# EAGLE design Motor controller v8 (EAGLE 7.4.0)
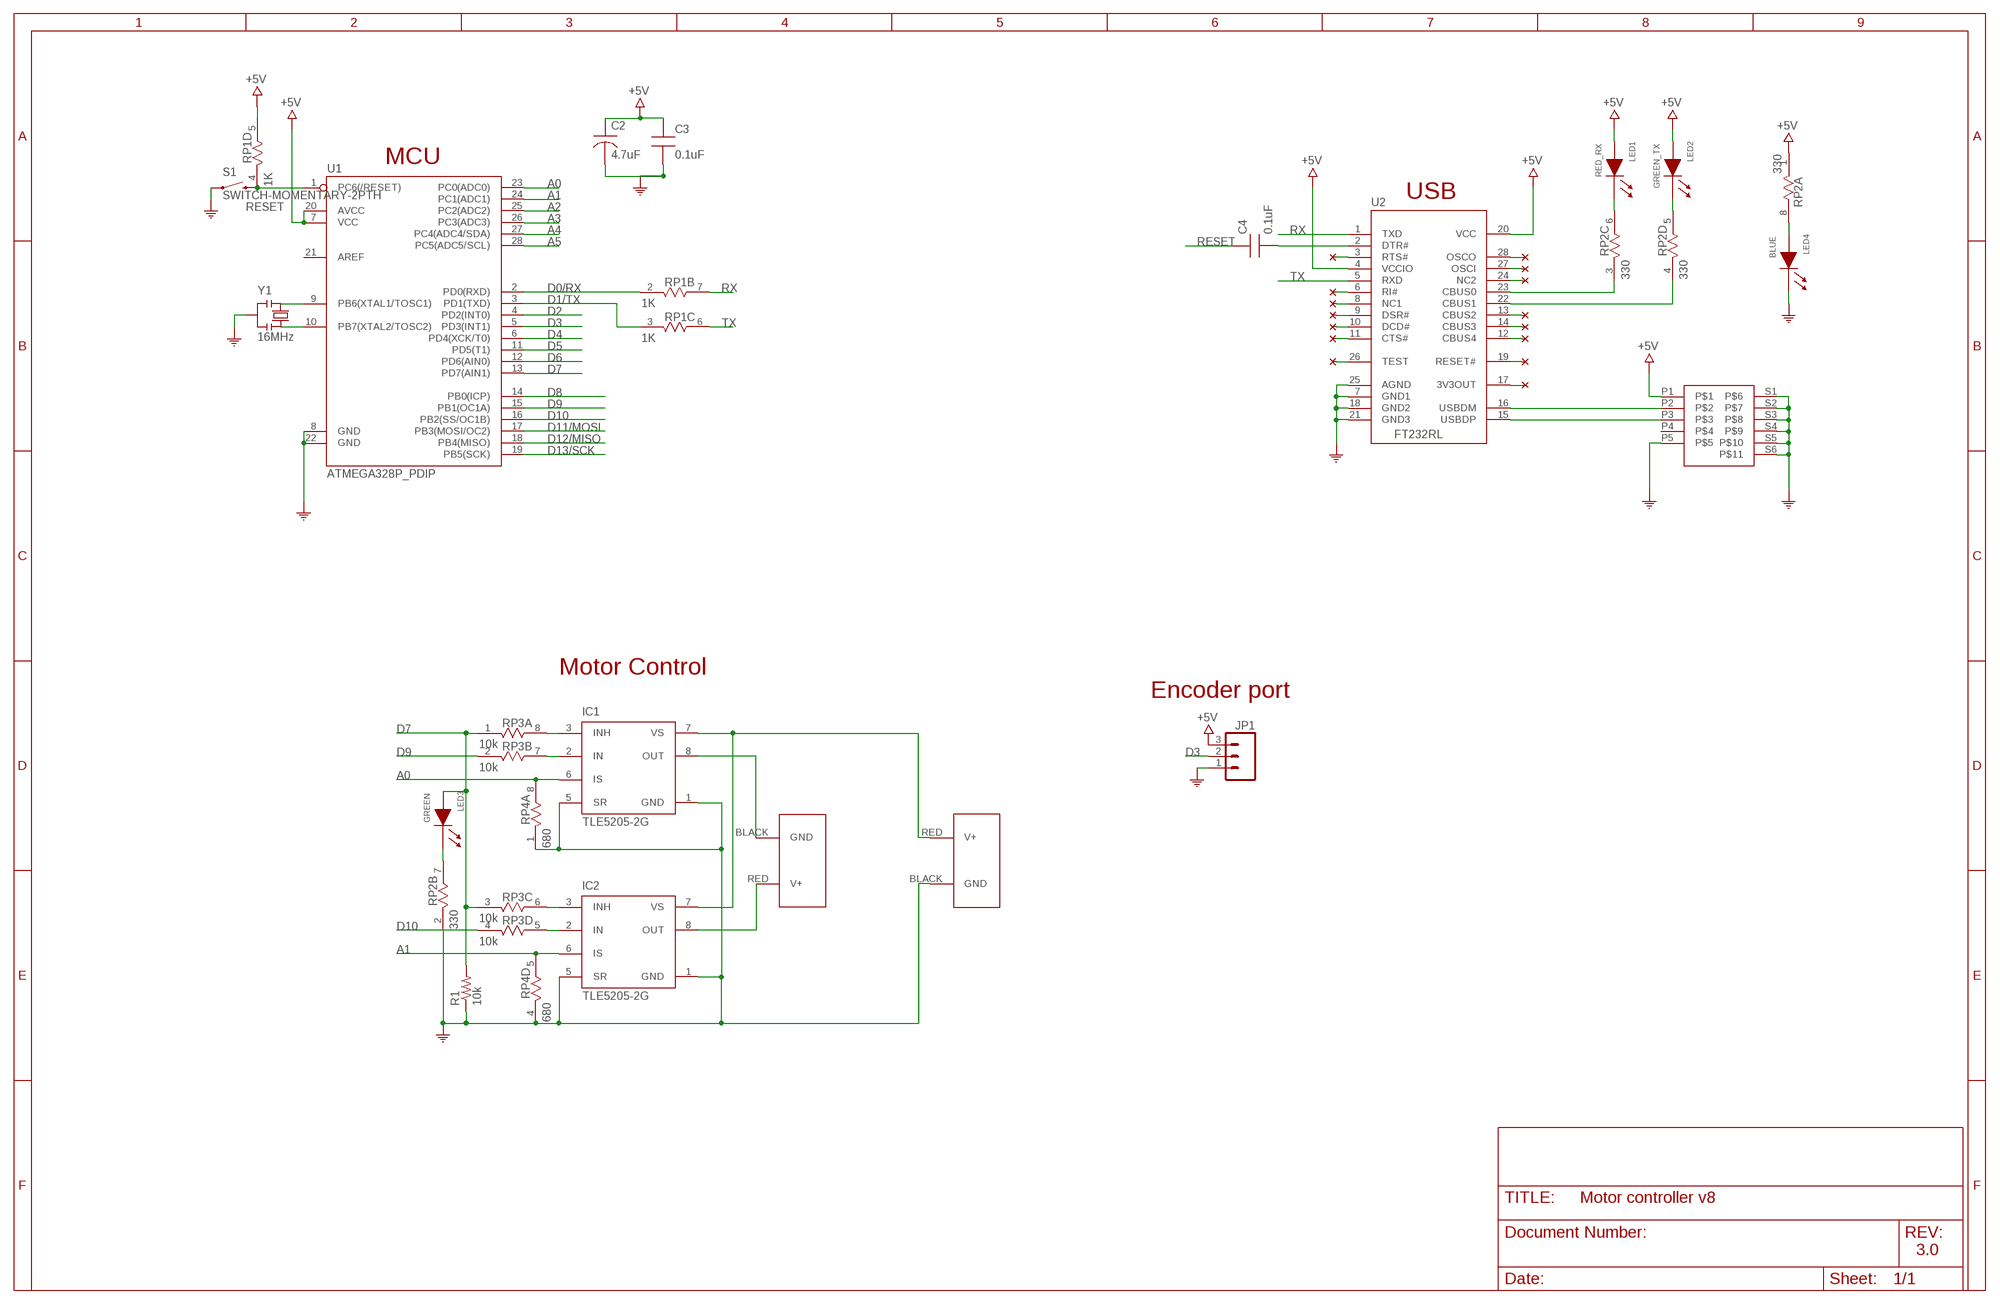
[diagram p0: schematic, sheet 1]

## Parts
C2  4.7uF  CAP-TANA-P  [TAN-A]
C3  0.1uF  CAP0805-NP  [CAP0805-NP]
C4  0.1uF  CAP0805-NP  [CAP0805-NP]
IC1  TLE5205-2G  [P-TO263-7-1]
IC2  TLE5205-2G  [P-TO263-7-1]
J2  POWERPOLE_POWER25A_HORIZONTAL_G2  [POWERPOLE_PAIR_25A_HORIZ_G2]
J3  POWERPOLE_POWER25A_HORIZONTAL_G2  [POWERPOLE_PAIR_25A_HORIZ_G2]
JP1  M03JST-PTH  [JST-3-PTH]
LED1  RED_RX  LED0805  [LED0805]
LED2  GREEN_TX  LED0805  [LED0805]
LED3  GREEN  LED0805  [LED0805]
LED4  BLUE  LED0805  [LED0805]
R1  10k  RESISTOR0805-RES  [0805]
RP1  1K  RES4NT  [RES4NT]
RP2  330  RES4NT  [RES4NT]
RP3  10k  RES4NT  [RES4NT]
RP4  680  RES4NT  [RES4NT]
S1  SWITCH-MOMENTARY-2PTH  [TACTILE-PTH]
U1  ATMEGA328P_PDIP  [DIL28-3]
U2  FT232RL  [SSOP28]
U$8  USB  [CON2_USB_MICRO_B_AT]
Y1  16MHz  RESONATORMU  [RESONATOR]

## Nets
+5V: C2.1 C3.1 JP1.3 LED1.2(AN) LED2.2(AN) RP1.5 RP2.1 U1.7(VCC) U1.20(AVCC) U2.4(VCCIO) U2.20(VCC) U$8.P1
A0: IC1.6(IS) RP4.8 U1.23(PC0(ADC0))
A1: IC2.6(IS) RP4.5 U1.24(PC1(ADC1))
A2: U1.25(PC2(ADC2))
A3: U1.26(PC3(ADC3))
A4: U1.27(PC4(ADC4/SDA))
A5: U1.28(PC5(ADC5/SCL))
D0/RX: RP1.2 U1.2(PD0(RXD))
D1/TX: RP1.3 U1.3(PD1(TXD))
D2: U1.4(PD2(INT0))
D3: JP1.2 U1.5(PD3(INT1))
D4: U1.6(PD4(XCK/T0))
D5: U1.11(PD5(T1))
D6: U1.12(PD6(AIN0))
D7: LED3.2(AN) R1.2 RP3.1 RP3.3 U1.13(PD7(AIN1))
D8: U1.14(PB0(ICP))
D9: RP3.2 U1.15(PB1(OC1A))
D10: RP3.4 U1.16(PB2(SS/OC1B))
D11/MOSI: U1.17(PB3(MOSI/OC2))
D12/MISO: U1.18(PB4(MISO))
D13/SCK: U1.19(PB5(SCK))
GND: C2.2 C3.2 IC1.1(GND) IC1.5(SR) IC2.1(GND) IC2.5(SR) J3.BLACK(GND) JP1.1 LED4.1(CA) R1.1 RP2.2 RP4.1 RP4.4 S1.1 U1.8(GND) U1.22(GND) U2.7(GND1) U2.18(GND2) U2.21(GND3) U2.25(AGND) U$8.P5 U$8.S1 U$8.S2 U$8.S3 U$8.S4 U$8.S5 U$8.S6 Y1.2 ; supply symbol labelled COM
N$1: U1.9(PB6(XTAL1/TOSC1)) Y1.1
N$2: U1.10(PB7(XTAL2/TOSC2)) Y1.3
N$3: LED4.2(AN) RP2.8
N$4: C4.2 U2.2(DTR#)
N$5: U2.15(USBDP) U$8.P3
N$6: U2.16(USBDM) U$8.P2
N$7: U2.17(3V3OUT)
N$8: RP2.3 U2.23(CBUS0)
N$9: RP2.4 U2.22(CBUS1)
N$10: LED1.1(CA) RP2.6
N$11: LED2.1(CA) RP2.5
N$12: U2.11(CTS#)
N$13: U2.6(RI#)
N$14: U2.8(NC1)
N$15: U2.9(DSR#)
N$16: U2.10(DCD#)
N$17: U2.28(OSCO)
N$18: U2.27(OSCI)
N$19: U2.24(NC2)
N$20: U2.13(CBUS2)
N$21: U2.14(CBUS3)
N$22: U2.12(CBUS4)
N$23: U2.19(RESET#)
N$24: LED3.1(CA) RP2.7
N$25: IC1.3(INH) RP3.8
N$26: U2.26(TEST)
N$27: U2.3(RTS#)
N$28: IC2.3(INH) RP3.6
N$34: IC1.2(IN) RP3.7
N$35: IC2.2(IN) RP3.5
N$40: IC1.8(OUT) J2.BLACK(GND)
N$41: IC2.8(OUT) J2.RED(V+)
RESET: C4.1 RP1.4 S1.3 U1.1(PC6(/RESET))
RX: RP1.7 U2.1(TXD)
TX: RP1.6 U2.5(RXD)
VCC: IC1.7(VS) IC2.7(VS) J3.RED(V+)
Unconnected: RP1.1 RP1.8 RP4.2 RP4.3 RP4.6 RP4.7 U1.21(AREF) U$8.P4

## Notes on the sheet
- MCU
- USB
- Motor Control
- Encoder port
- 3.0

## Library data of the parts
C2 = MySMD:CAP-TANA-P
C3 C4 = MySMD:CAP0805-NP
IC1 IC2 = New controller:TLE5205-2: 5-A H-Bridge for DC-Motor Applications Source: http://www.infineon.com .. tle5205-2.pdf
J2 J3 = powerpoles:POWERPOLE_POWER: Anderson Powerpole Power Connector using ameteur radio standard layout
JP1 = SparkFun-Connectors:M03: Header 3 Standard 3-pin 0.1" header. Use with straight break away headers (SKU : PRT-00116), right angle break away headers (PRT-00553), swiss pins (PRT-00743), machine pins (PRT-00117), and female headers (PRT-00115). Molex polarized connector foot print use with SKU : PRT-08232 with associated crimp pins and housings.; SKU: PRT-09915
LED1-LED4 = MySMD:LED0805
R1 = SparkFun-Passives:RESISTOR: Resistor Basic schematic elements and footprints for 0603, 1206, and PTH resistors.
RP1-RP4 = MySMD:RES4NT
S1 = SparkFun-Electromechanical:SWITCH-MOMENTARY-2: Various NO switches- pushbuttons, reed, etc; PROD_ID: SWCH-08441
U1 = SparkFun-DigitalIC:ATMEGA328P_PDIP: uC used in the Arduino 32kb flash, 1k EEPROM, 2k SRAM This is the through-hole version of this chip.
U2 = MySMD2:FT232RL
U$8 = Arduino_Micro_Rev03j:USB
Y1 = MySMD2:RESONATOR

## Net classes
0 default: clearance 0.205 mm

## Board
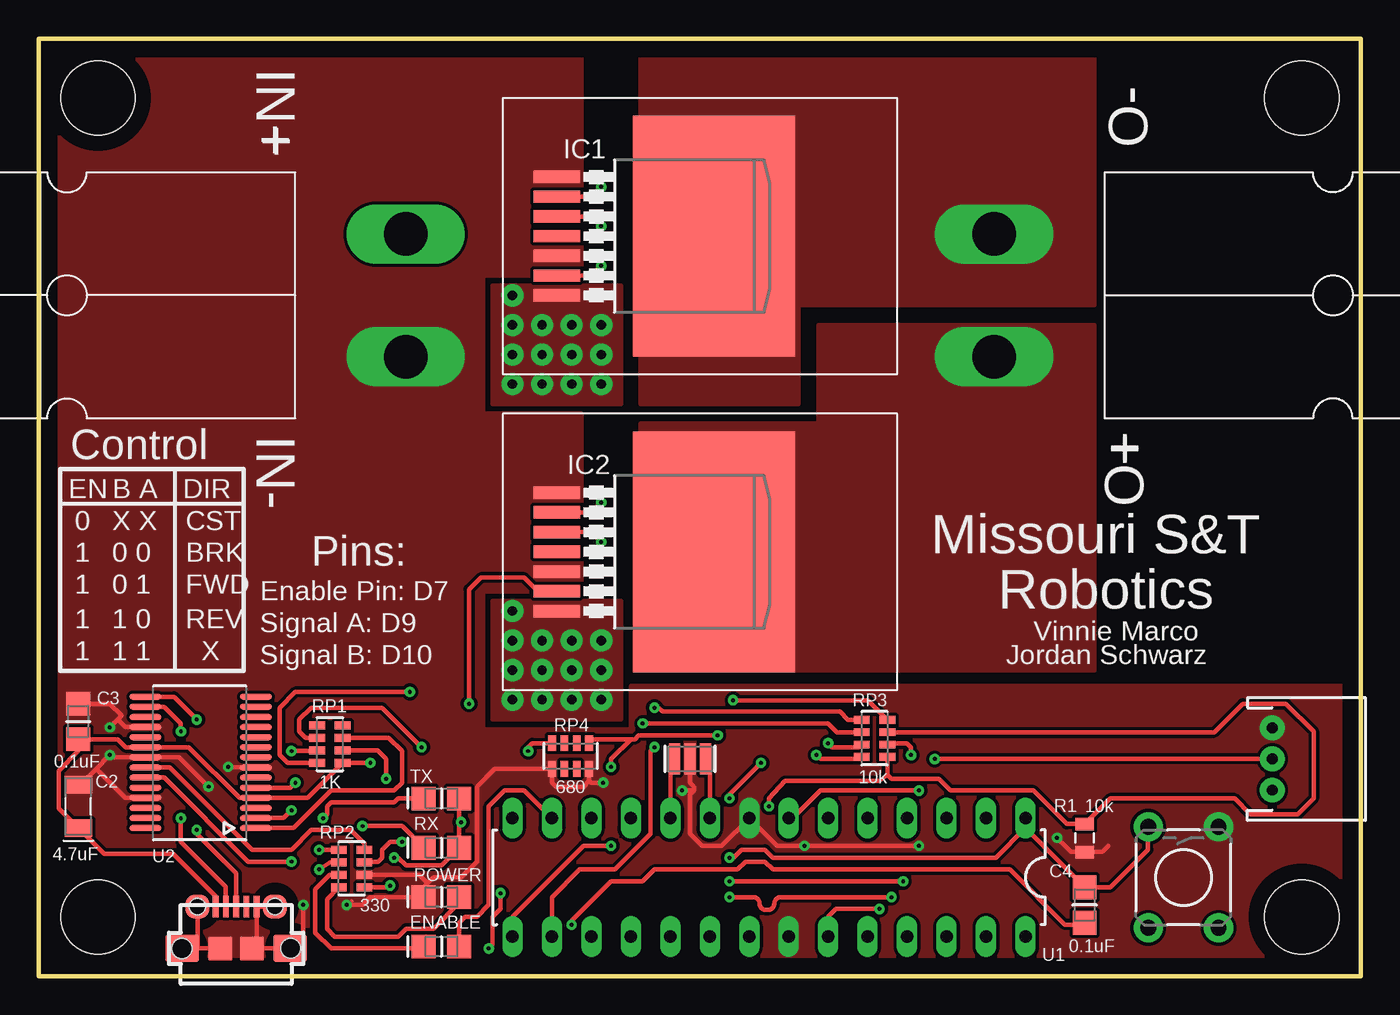
[diagram p1: board, top side]
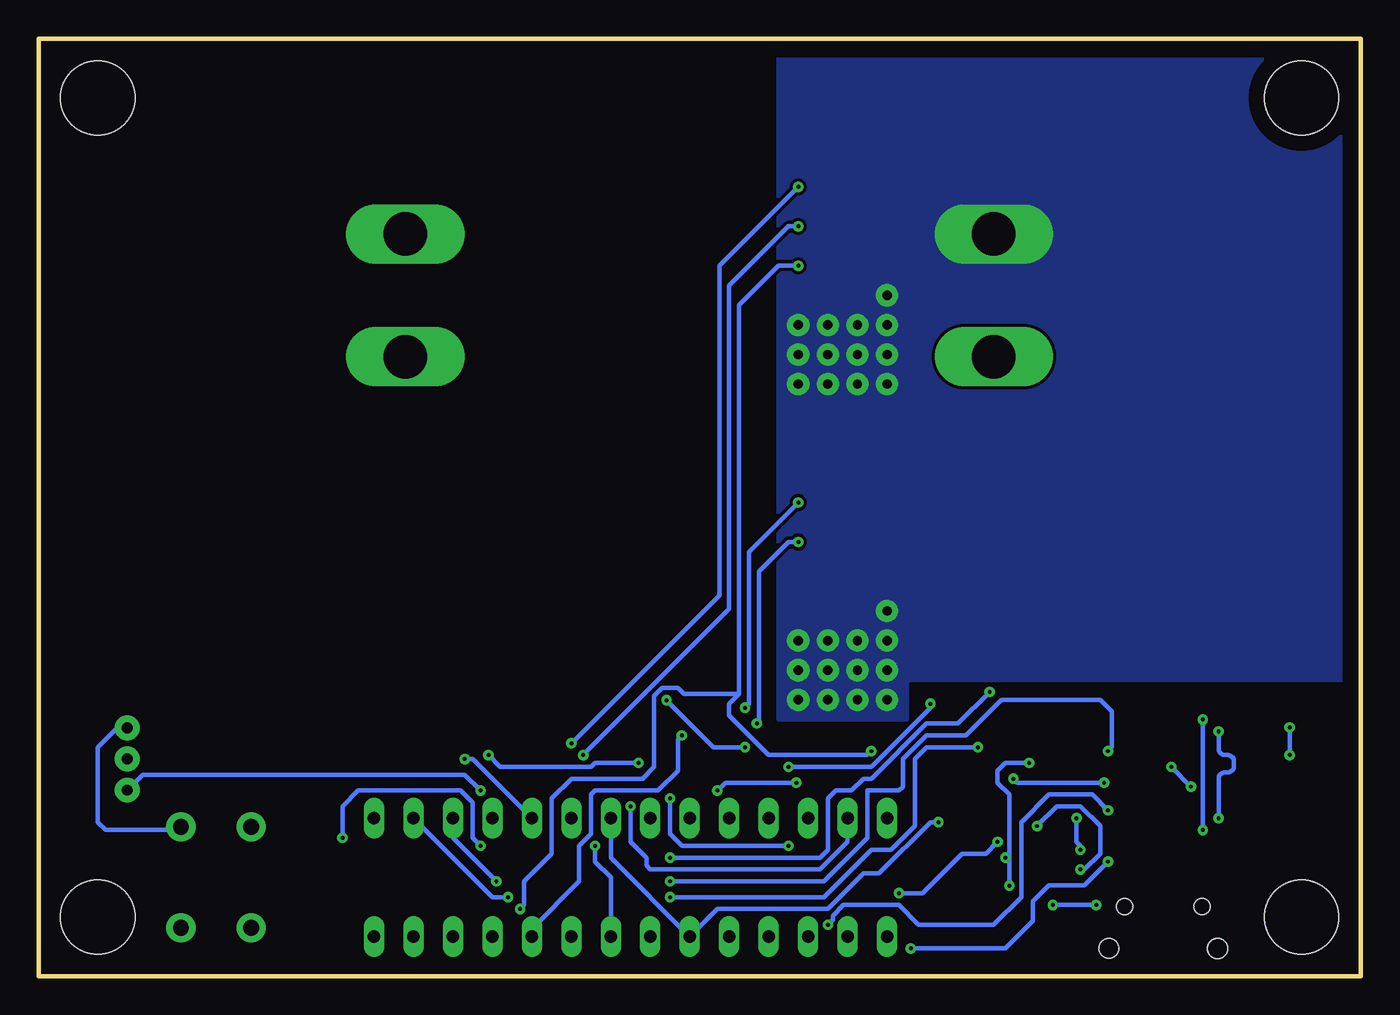
[diagram p2: board, bottom side, seen from below]

Size 85.07 x 60.33 mm. Coordinates in mm from the lower left corner, seen from the top.
Outline: 0,0 85.07,0 85.07,60.33 0,60.33 0,0
Copper layers (1*16): Top 0.035mm / dielectric 1.5mm / Bottom 0.035mm
Design rules "default *": minimum track width 10mil, minimum drill 6mil, track to track 8mil, track to pad 8mil, pad to pad 8mil, via to via 8mil, smd to smd 8mil, copper to edge 40mil, drill to drill 8mil, minimum pad ring 10mil, minimum via ring 8mil, stop-mask expansion 4mil, vias tented up to drill 0mil, thermal gap 10mil
Holes 4.76 mm at 3.81,3.81 81.28,3.81 3.81,56.52 81.28,56.52

### Footprints (pad centres in the part's own frame; a part is rotated, then mirrored left to right if it is on the bottom)
TAN-A = smd 1.118 x 1.778: 1 0,0; 2 2.794,0
CAP0805-NP = smd 1.524 x 1.524: 1 0,0; 2 2.286,0
P-TO263-7-1 = smd 0.8 x 3: 1 -3.81,-9.207; 2 -2.54,-9.207; 3 -1.27,-9.207; 4 0,-9.207; 5 1.27,-9.207; 6 2.54,-9.207; 7 3.81,-9.207 | smd 15.494 x 10.414: 8 0,0.895
POWERPOLE_PAIR_25A_HORIZ_G2 = drill 2.8 long: BLACK -3.95,-7.1; RED 3.95,-7.1
JST-3-PTH = drill 0.7 pad 1.6: 1 -2,0; 2 0,0; 3 2,0
LED0805 = smd 1.524 x 1.524: 1 0,0; 2 2.286,0
0805 = smd 0.8 x 1.2: 1 -0.9,0; 2 0.9,0
RES4NT = smd 0.508 x 1.016: 1 0,0; 2 0.8,0; 3 1.6,0; 4 2.4,0; 5 2.4,1.651; 6 1.6,1.651; 7 0.8,1.651; 8 0,1.651
TACTILE-PTH = drill 1.016 pad 1.88: 1 -3.251,2.261; 2 3.251,2.261; 3 -3.251,-2.261; 4 3.251,-2.261
DIL28-3 = drill 0.813 long: 1 -16.51,-3.81; 2 -13.97,-3.81; 3 -11.43,-3.81; 4 -8.89,-3.81; 5 -6.35,-3.81; 6 -3.81,-3.81; 7 -1.27,-3.81; 8 1.27,-3.81; 9 3.81,-3.81; 10 6.35,-3.81; 11 8.89,-3.81; 12 11.43,-3.81; 13 13.97,-3.81; 14 16.51,-3.81; 15 16.51,3.81; 16 13.97,3.81; 17 11.43,3.81; 18 8.89,3.81; 19 6.35,3.81; 20 3.81,3.81; 21 1.27,3.81; 22 -1.27,3.81; 23 -3.81,3.81; 24 -6.35,3.81; 25 -8.89,3.81; 26 -11.43,3.81; 27 -13.97,3.81; 28 -16.51,3.81
SSOP28 = smd 0.381 x 2.032: 1 0,0; 2 0.65,0; 3 1.3,0; 4 1.95,0; 5 2.6,0; 6 3.25,0; 7 3.9,0; 8 4.55,0; 9 5.2,0; 10 5.85,0; 11 6.5,0; 12 7.15,0; 13 7.8,0; 14 8.45,0; 15 8.45,7.112; 16 7.8,7.112; 17 7.15,7.112; 18 6.5,7.112; 19 5.85,7.112; 20 5.2,7.112; 21 4.55,7.112; 22 3.9,7.112; 23 3.25,7.112; 24 2.6,7.112; 25 1.95,7.112; 26 1.3,7.112; 27 0.65,7.112; 28 0,7.112
CON2_USB_MICRO_B_AT = smd 0.406 x 1.346: P1 -1.321,2.692; P2 -0.66,2.692; P3 0,2.692; P4 0.66,2.692; P5 1.321,2.692 | smd 2.159 x 1.778: S1 -3.473,0; S2 3.473,0 | smd 1.524 x 1.524: S3 -2.489,2.692; S4 2.489,2.692; S5 -1.016,0; S6 1.016,0 | hole 1.016: -2.484,2.701; 2.492,2.692 | hole 1.27: -3.492,0; 3.508,0.003
RESONATOR = smd 0.7 x 2: 1 -1,0; 2 0,0; 3 1,0

### Placement (x,y rotation side)
C2  2.54,9.53 90 top
C3  2.54,15.24 90 top
C4  67.31,5.71 270 top
IC1  42.55,47.62 270 top
IC2  42.55,27.3 270 top
J2  68.58,43.81 270 top
J3  16.51,43.81 90 top
JP1  79.38,13.97 270 top
LED1  24.77,8.26 0 top
LED2  24.77,11.43 0 top
LED3  24.77,1.91 0 top
LED4  24.77,5.08 0 top
R1  67.31,8.89 90 top
RP1  17.91,16.13 270 top
RP2  20.95,5.71 90 top
RP3  54.61,14.1 90 top
RP4  33.02,13.34 0 top
S1  73.66,6.35 270 top
U1  46.99,6.35 180 top
U2  13.97,9.53 90 top
U$8  12.7,1.78 0 top
Y1  41.91,13.97 180 top

### Tracks (layer width: path | path; a pad name or v marks a point on that pad's centre or on a via)
+5V  (via drill 0.25)
  Top 0.305: C2.1 1.27,10.79 1.27,13.21 2.54,14.48 C3.1 5.08,15.24 5.59,14.73 6.85,14.73 U2.20 6.87,14.73 9.65,14.73 12.91,11.47 U2.4 17.3,11.47 RP1.5 19.57,13.72 v21.34,13.72 | LED2.2 27.05,10.03 v27.18,9.91 27.05,9.78 LED1.2 25.91,7.11 23.62,7.11 23.11,7.62 v22.86,7.62 | U1.7 48.51,10.16 50.29,11.94 v56.64,11.94 | C2.1 2.67,9.53 | C2.1 4.19,7.87 8.64,7.87 11.38,5.13 U$8.P1 | RP2.1 22.48,5.71 v22.61,5.82
  Bottom 0.305: U1.7 48.26,7.62 U1.20 41.4,4.32 34.29,4.32 32,6.6 30.99,6.6 27.69,9.91 v27.18,9.91 | 78.9,12.45 JP1.3 78.39,12.95 57.66,12.95 v56.64,11.94 | v22.61,5.82 22.61,7.37 | 22.61,7.37 v22.86,7.62 | 22.61,7.37 22.61,11.68 23.37,12.45 23.37,13.21 22.86,13.72 v21.34,13.72
A0  (via drill 0.25, 0.25 pad 0.66)
  Top 0.305: IC1.6 35.56,45.09 v36.2,45.72 | v54.1,4.32 51.31,4.32 50.8,3.81 U1.23 | v31.5,14.48 31.5,14.73 31.75,14.99 RP4.8
  Bottom 0.305: v36.2,45.72 37.47,45.72 40.01,43.18 40.01,18.16 | 40.01,18.16 40.64,17.53 40.64,16.76 38.1,14.22 31.75,14.22 v31.5,14.48 | 40.01,18.16 43.56,18.16 43.94,18.54 44.96,18.54 45.47,18.03 45.47,13.46 46.23,12.7 50.8,12.7 52.07,11.43 52.07,7.87 53.85,6.1 53.85,4.57 v54.1,4.32
A1  (via drill 0.25)
  Top 0.305: v43.69,15.49 38.61,15.49 38.35,15.24 38.1,15.24 | 38.1,15.24 35.67,15.24 RP4.5 | IC2.6 32.13,24.77 31.24,25.65 28.45,25.65 27.69,24.89 v27.69,17.53 | v36.83,13.46 36.83,13.97 38.1,15.24
  Bottom 0.305: v43.69,15.49 43.94,15.24 43.94,13.21 45.21,11.94 49.28,11.94 49.53,11.68 49.53,9.14 50.29,8.38 50.29,6.1 53.34,3.05 U1.24 | v27.69,17.53 27.69,17.27 31.5,13.46 v36.83,13.46
D0/RX  (via drill 0.25)
  Top 0.305: v54.86,5.08 47.74,5.08 arc90 47.33,4.67 arc-90 46.92,4.26 46.79,4.26 arc-90 46.38,4.67 arc90 45.97,5.08 v44.45,5.08 | v24.64,14.73 22.1,17.27 17.53,17.27 16.76,16.51 16.76,15.75 17.18,15.33 RP1.2
  Bottom 0.305: v24.64,14.73 27.94,14.73 28.7,13.97 28.7,9.65 30.23,8.13 31.5,8.13 34.54,5.08 v44.45,5.08 | v54.86,5.08 55.88,5.08 U1.2
D1/TX  (via drill 0.25)
  Top 0.305: v16.26,14.48 17.86,14.48 RP1.3 | v44.45,6.1 v55.63,6.1
  Bottom 0.305: U1.3 58.42,8.89 v55.63,6.1 | v44.45,6.1 34.54,6.1 31.75,8.89 31.75,11.94 29.72,11.94 29.46,12.19 29.46,13.97 27.94,15.49 25.4,15.49 23.11,17.78 16.76,17.78 16,17.02 16,14.73 v16.26,14.48
D3  (via drill 0.25)
  Top 0.305: JP1.2 v57.66,13.97
  Bottom 0.305: v57.66,13.97 57.15,13.97 U1.5
D7  (via drill 0.25)
  Top 0.305: LED3.2 27.05,3.43 27.43,3.81 28.19,3.81 28.96,4.57 28.96,10.92 29.97,11.94 31.24,11.94 U1.13 | 54.61,12.95 RP3.1 | 54.61,12.95 54.86,12.7 57.91,12.7 58.67,11.94 64.01,11.94 66.16,9.79 R1.2 68.95,11.43 76.96,11.43 77.98,10.41 81.03,10.41 82.04,11.43 82.04,15.75 80.26,17.53 77.47,17.53 75.64,15.7 RP3.3 | v46.99,10.92 46.99,11.43 48.01,12.55 54.1,12.55 54.61,12.95
  Bottom 0.305: U1.13 33.02,8.64 34.8,6.86 45.72,6.86 45.97,7.11 45.97,7.62 46.99,8.64 v46.99,10.92
D9  (via drill 0.25)
  Top 0.305: U1.15 30.48,3.81 35.05,8.38 v36.83,8.38 | v44.45,11.43 44.45,11.68 v46.48,13.72 | v56.13,14.22 56.13,14.73 55.88,14.99 55.12,14.99 55.03,14.9 RP3.2
  Bottom 0.305: v36.83,8.38 43.69,8.38 44.45,9.14 v44.45,11.43 | v46.48,13.72 49.28,13.72 49.53,13.46 55.37,13.46 v56.13,14.22
D10  (via drill 0.25)
  Top 0.305: U1.16 33.02,5.08 34.8,6.86 37.08,6.86 39.37,9.14 39.37,14.48 v39.62,14.73 | RP3.4 53.35,17.75 v44.68,17.75
  Bottom 0.305: v39.62,14.73 41.66,14.73 v44.68,17.75
GND  (via drill 0.25)
  Top 0.305: 20.14,4.83 v19.81,4.57 20.83,4.57 21.34,5.08 LED4.1 24.77,5.71 25.02,5.97 | U2.18 5.57,16.02 5.08,16.51 | C3.2 4.57,17.53 5.33,16.76 5.08,16.51 | v4.57,16 5.08,16.51 | C2.2 2.67,12.32 3.68,13.34 | 3.68,13.34 v4.57,14.22 4.72,14.07 U2.21 9.04,14.07 v10.92,12.19 | U2.25 5.54,11.47 3.68,13.34 | U2.7 12.23,13.43 v12.19,13.46 | 42.16,11.94 42.16,12.19 41.91,12.45 Y1.2 | v36.32,12.45 35.56,12.45 35.42,12.59 RP4.4 35.42,12.56 35.05,12.19 33.27,12.19 33.02,12.45 RP4.1 29.34,13.34 28.19,12.19 28.19,7.37 27.18,6.35 25.4,6.35 25.02,5.97 | v41.4,11.94 42.16,11.94 | v56.64,8.38 v49.28,8.38 47.5,8.38 U1.8 43.94,8.38 42.67,8.38 41.91,9.14 41.91,11.68 42.16,11.94 | v65.53,8.89 66.43,7.99 R1.1 68.44,7.99 68.83,8.38 | RP2.2 24.47,6.51 25.02,5.97 | 8.89,1.78 U$8.S1 10.21,1.78 | 10.21,1.78 U$8.S3 | 10.21,1.78 12.19,1.78 | v17.02,4.57 17.02,2.62 U$8.S2 U$8.S6 14.02,1.78 U$8.P5 U$8.S4
  Bottom 0.305: v19.81,4.57 v17.02,4.57 | v4.57,14.22 v4.57,16 | U1.22 48.26,6.35 49.28,7.37 v49.28,8.38 | v36.32,12.45 40.89,12.45 v41.4,11.94 | v56.64,8.38 57.15,8.89 57.15,11.18 57.91,11.94 64.52,11.94 65.53,10.92 v65.53,8.89 | v12.19,13.46 v10.92,12.19 | JP1.1 80.04,15.97 81.28,14.73 81.28,9.91 80.77,9.4 76.12,9.4 S1.1
  pour Top (no thermals): 0.64,59.69 34.92,59.69 34.92,45.09 28.57,45.09 28.57,36.2 34.92,36.2 34.92,24.77 28.57,24.77 28.57,15.88 38.1,15.88 38.1,18.67 84.45,18.67 84.45,0.64 0.64,0.64
N$1
  Top 0.305: U1.9 43.18,13.7 Y1.1
N$2
  Top 0.305: U1.10 40.64,13.7 Y1.3
N$3
  Top 0.305: LED4.2 27.05,4.7 25.4,3.05 23.62,3.05 23.11,2.54 19.05,2.54 18.54,3.05 18.54,4.95 RP2.8
N$4  (via drill 0.25)
  Top 0.305: U2.2 15.76,10.18 v16.26,10.67 | v34.29,3.3 34.29,3.56 36.83,6.1 38.86,6.1 39.62,6.86 44.96,6.86 45.47,7.37 46.74,7.37 47.24,6.86 62.48,6.86 66.04,3.3 67.18,3.3 C4.2
  Bottom 0.305: v16.26,10.67 17.27,11.68 20.07,11.68 21.84,9.91 21.84,5.08 23.62,3.3 28.45,3.3 29.72,4.57 33.27,4.57 33.96,3.89 33.96,3.63 v34.29,3.3
N$5  (via drill 0.25)
  Top 0.305: v10.16,16.51 8.7,17.98 U2.15 | v10.16,9.4 10.16,9.14 12.7,6.6 U$8.P3
  Bottom 0.305: v10.16,16.51 v10.16,9.4
N$6  (via drill 0.25)
  Top 0.305: v9.14,15.75 9.14,16.26 8.07,17.32 U2.16 | v9.14,10.16 9.14,8.64 12.04,5.74 U$8.P2
  Bottom 0.305: v9.14,15.75 9.14,14.63 arc-90 8.73,14.22 8.56,14.22 arc90 8.15,13.81 8.15,13.52 arc90 8.56,13.11 8.73,13.11 arc-90 9.14,12.7 v9.14,10.16
N$8  (via drill 0.25)
  Top 0.305: U2.23 8.05,12.78 13.46,7.37 v16.26,7.37 | RP2.3 20.9,7.37 21.84,7.37 22.1,7.62 22.1,8.13 22.61,8.64 v23.37,8.64 | v29.72,5.33 29.72,4.32 29.21,3.81 29.21,2.03 v28.96,1.78
  Bottom 0.305: v23.37,8.64 24.13,7.87 25.65,7.87 28.19,5.33 v29.72,5.33 | v28.96,1.78 22.86,1.78 21.08,3.56 21.08,4.83 20.07,5.84 17.78,5.84 v16.26,7.37
N$9
  Top 0.305: U2.22 8.42,13.43 13.72,8.13 16.26,8.13 17.53,9.4 20.07,9.4 20.93,8.53 20.95,8.53 RP2.4
N$10  (via drill 0.25)
  Top 0.305: RP2.6 18.75,7.32 v18.03,6.86 | v20.83,9.65 23.37,9.65 LED1.1
  Bottom 0.305: v18.03,6.86 17.78,6.86 16.76,7.87 16.76,9.65 18.03,10.92 19.56,10.92 v20.83,9.65
N$11  (via drill 0.25)
  Top 0.305: LED2.1 23.11,11.43 22.86,11.18 18.8,11.18 18.54,10.92 18.54,10.41 v18.29,10.16 | v18.03,8.13 RP2.5
  Bottom 0.305: v18.29,10.16 18.29,8.64 18.03,8.38 v18.03,8.13
N$24
  Top 0.305: RP2.7 18.71,6.51 17.78,5.59 17.78,2.79 18.8,1.78 24.64,1.78 LED3.1
N$25  (via drill 0.25, 0.25 pad 0.66)
  Top 0.305: IC1.3 35.56,48.9 v36.2,48.26 | v50.04,14.22 50.29,13.97 52.83,13.97 RP3.8
  Bottom 0.305: v36.2,48.26 36.83,48.26 40.64,44.45 40.64,23.62 v50.04,14.22
N$28  (via drill 0.25, 0.25 pad 0.66)
  Top 0.305: IC2.3 35.56,28.57 v36.2,27.94 | v38.86,16.26 50.8,16.26 51.36,15.7 RP3.6
  Bottom 0.305: v36.2,27.94 36.83,27.94 38.73,26.04 38.73,16.38 v38.86,16.26
N$34  (via drill 0.25, 0.25 pad 0.66)
  Top 0.305: IC1.2 35.56,50.16 v36.2,50.8 | v50.8,14.99 51.05,14.73 52.79,14.73 RP3.7
  Bottom 0.305: v36.2,50.8 41.27,45.72 41.27,24.51 v50.8,14.99
N$35  (via drill 0.25, 0.25 pad 0.66)
  Top 0.305: IC2.2 35.56,29.84 v36.2,30.48 | RP3.5 52.08,16.5 51.56,17.02 40.13,17.02 39.88,17.27 v39.62,17.27
  Bottom 0.305: v36.2,30.48 39.37,27.3 39.37,17.53 v39.62,17.27
N$40
  pour Top (no thermals): 38.73,59.69 67.94,59.69 67.94,43.18 48.9,43.18 48.9,36.83 38.73,36.83
N$41
  pour Top (no thermals): 38.73,35.56 50.16,35.56 50.16,41.91 67.94,41.91 67.94,19.68 38.73,19.68
RESET  (via drill 0.25)
  Top 0.305: S1.3 71.37,9.58 71.37,8.13 68.96,5.71 C4.1 63.5,9.53 | U1.1 63.5,9.53 | v44.45,7.62 44.7,7.62 45.21,8.13 46.74,8.13 47.24,7.62 61.59,7.62 63.5,9.53 | v23.88,18.29 16.51,18.29 15.49,17.27 15.49,14.22 16,13.72 17.89,13.72 RP1.4
  Bottom 0.305: v44.45,7.62 34.8,7.62 34.29,8.13 34.29,11.43 33.78,11.94 32.77,11.94 32,12.7 31.5,12.7 27.94,16.26 25.91,16.26 v23.88,18.29
RX
  Top 0.305: U2.1 16.38,9.53 18.8,11.94 22.86,11.94 23.37,12.45 23.37,14.48 22.52,15.33 RP1.7 19.65,15.24
TX  (via drill 0.25)
  Top 0.305: U2.5 16.19,12.12 v16.51,12.45 | v22.35,12.7 22.35,13.97 21.79,14.53 RP1.6
  Bottom 0.305: v16.51,12.45 22.1,12.45 v22.35,12.7
VCC  (via drill 0.6 pad 1.42)
  other vias: 30.48,43.81 30.48,41.91 30.48,40.01 30.48,38.1 32.38,38.1 34.29,38.1 34.29,40.01 32.38,40.01 32.38,41.91 34.29,41.91 30.48,23.5 30.48,21.59 30.48,19.68 30.48,17.78 32.38,17.78 34.29,17.78 34.29,19.68 32.38,19.68 32.38,21.59 34.29,21.59 36.2,21.59 36.2,19.68 36.2,17.78 36.2,41.91 36.2,40.01 36.2,38.1
  pour Bottom (no thermals): 0.64,59.69 37.47,59.69 37.47,16.51 29.21,16.51 29.21,19.05 0.64,19.05
  pour Top (no thermals): 37.47,44.45 29.21,44.45 29.21,36.83 37.47,36.83
  pour Top (no thermals): 37.47,24.13 29.21,24.13 29.21,16.51 37.47,16.51

### Text on the board
tPlace: IN+ | O- | IN- | Control | EN | B A | DIR | O+ | 0 | X X | CST | 1 | 0 0 | BRK | Missouri S&T | Pins: | 1 | 0 1 | FWD | Enable Pin: D7 | Robotics | 1 | 1 0 | REV | Signal A: D9 | Vinnie Marco | 1 | 1 1 | X | Signal B: D10 | Jordan Schwarz | TX | RX | POWER | ENABLE